# Altium schematic sheet 2-new-T03-V1.Sheet 1.SchDoc
size 594 x 419 mm
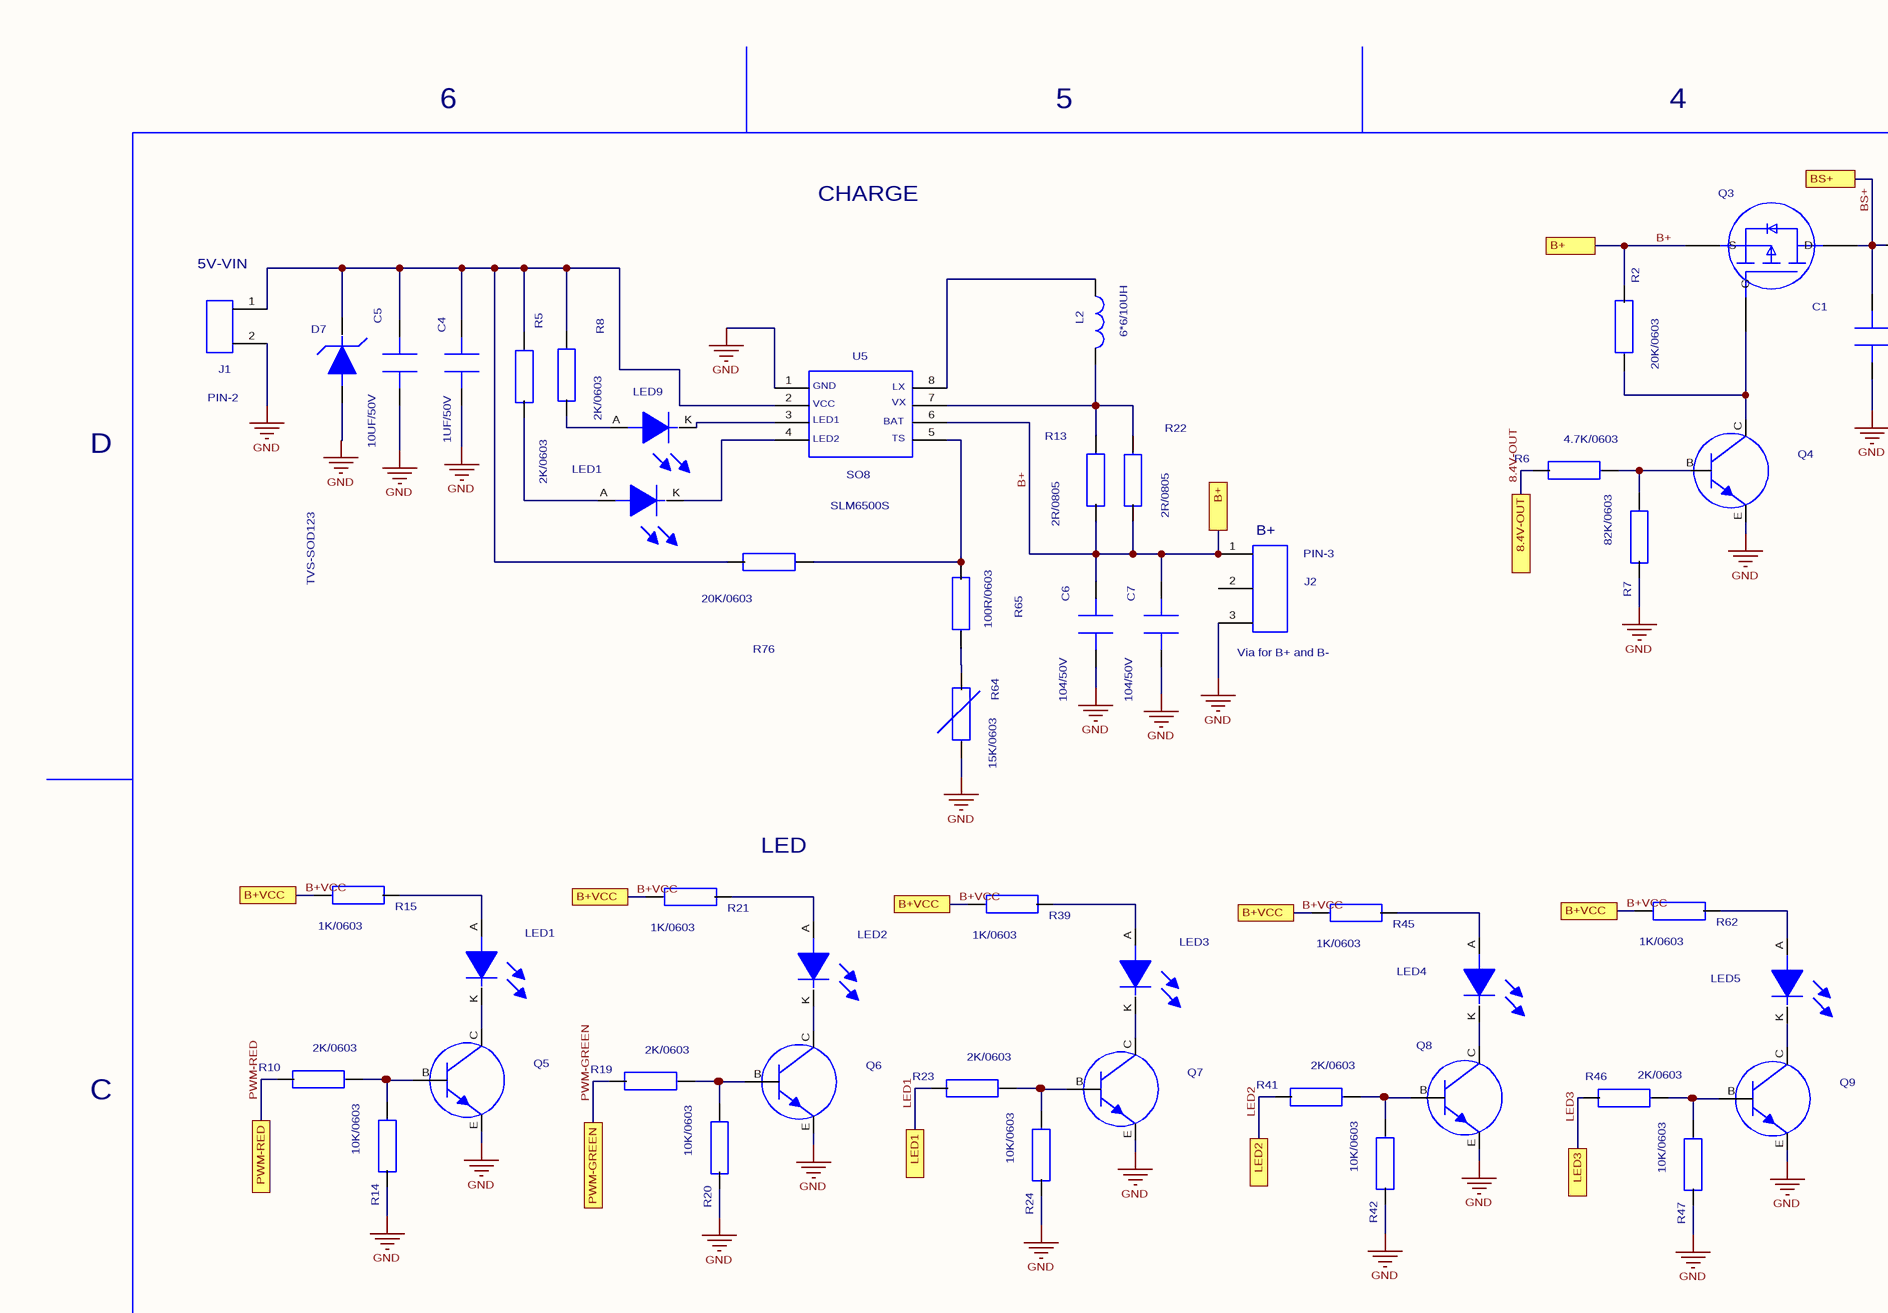
[diagram p0: 2-new-T03-V1.Sheet 1.SchDoc, top left]
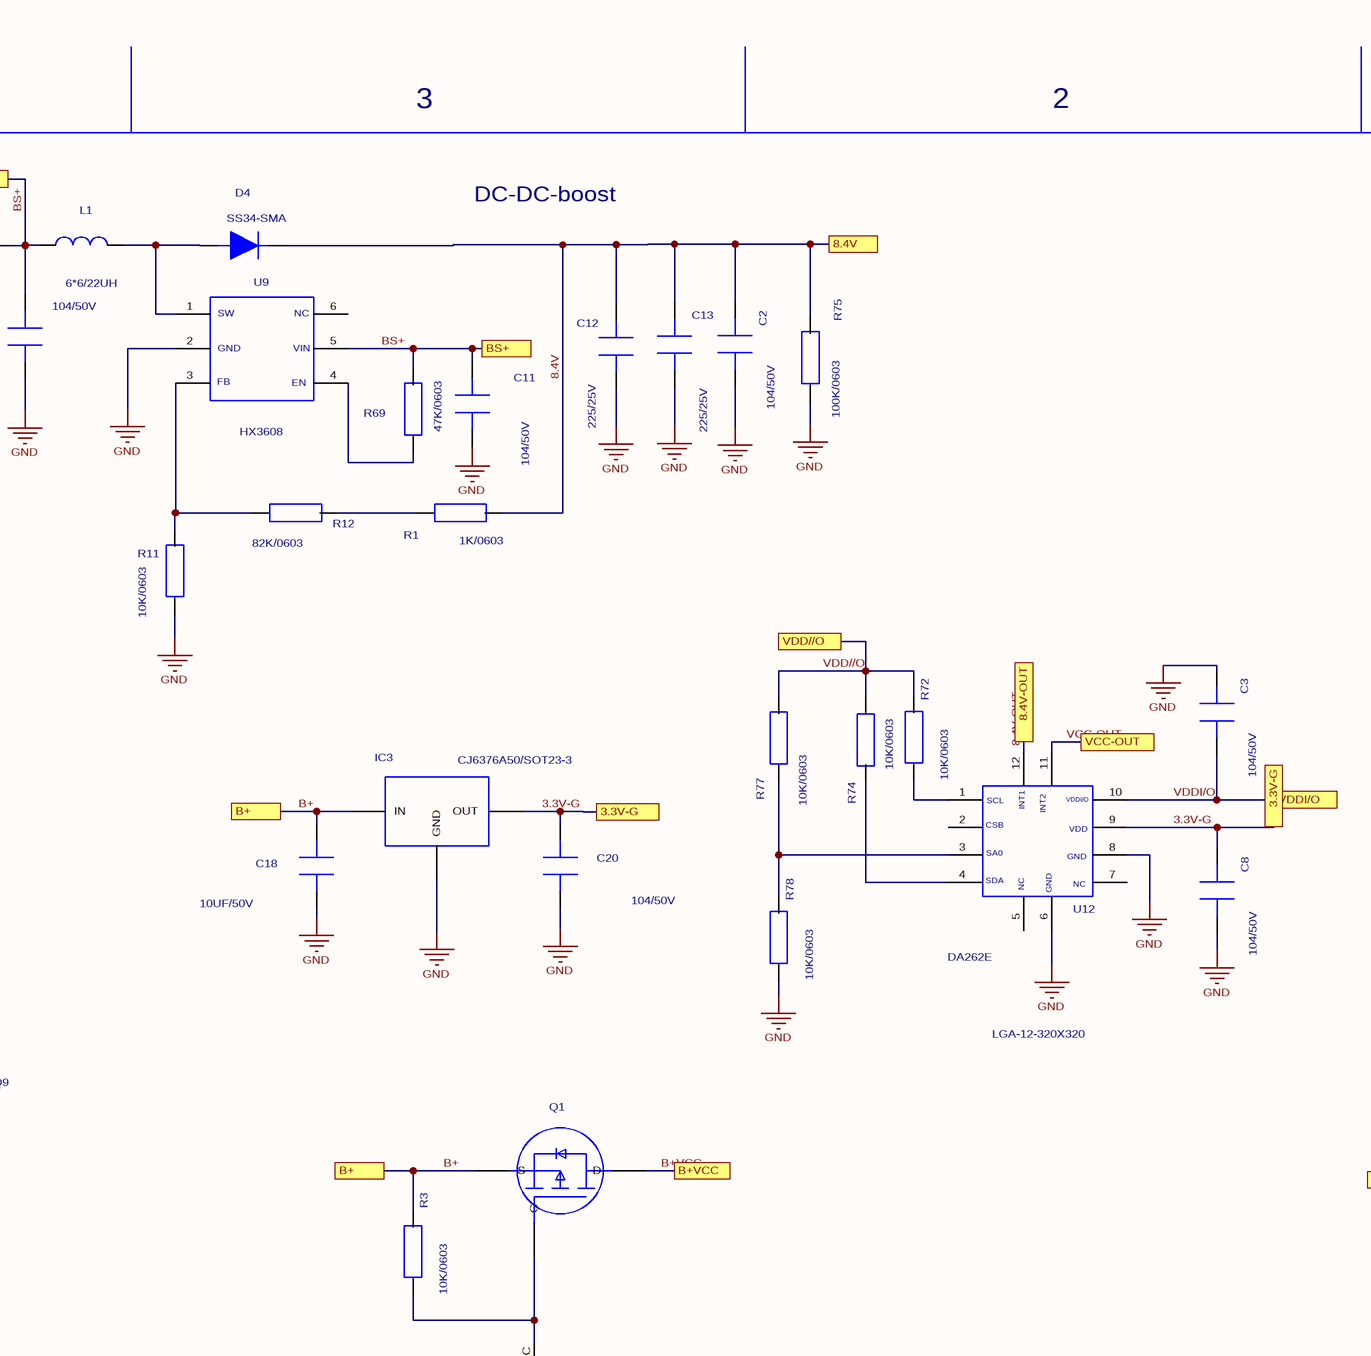
[diagram p1: 2-new-T03-V1.Sheet 1.SchDoc, top middle]
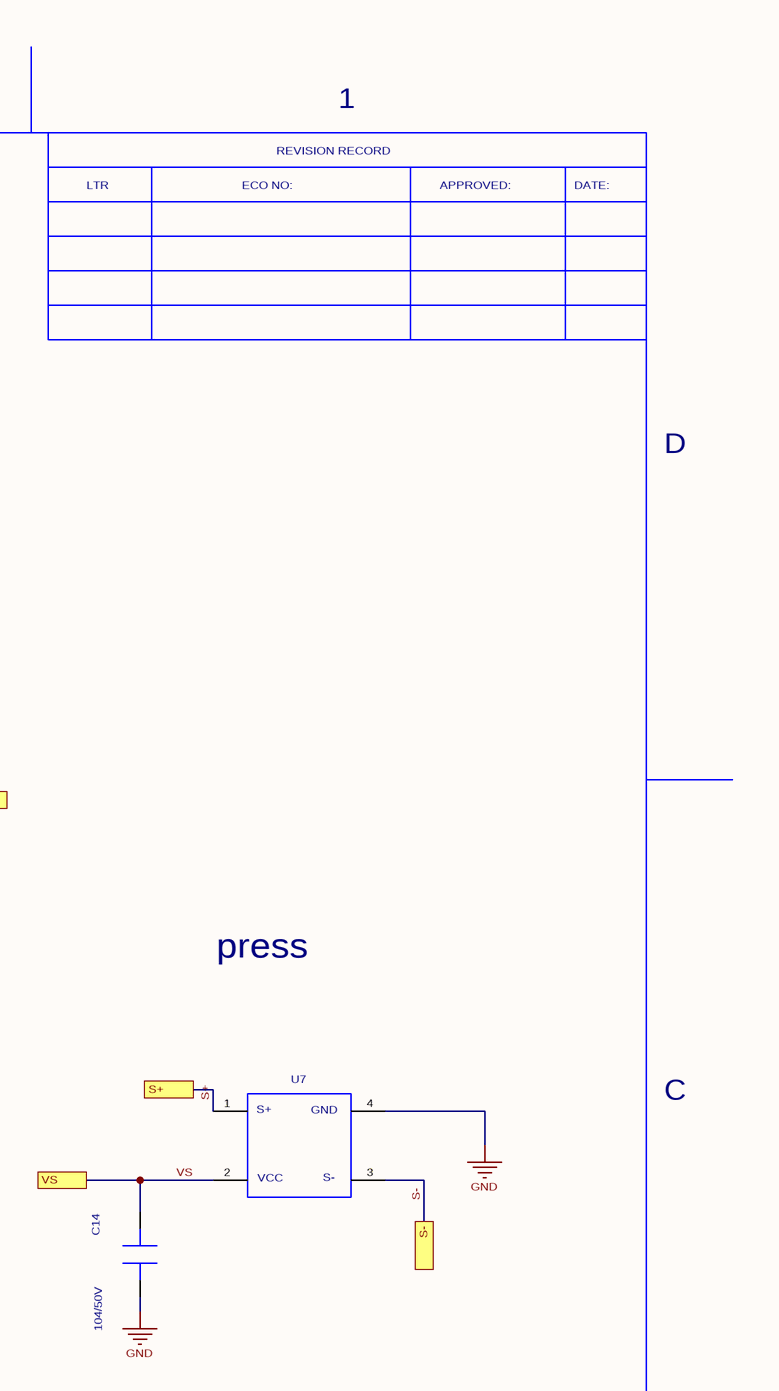
[diagram p2: 2-new-T03-V1.Sheet 1.SchDoc, top right]
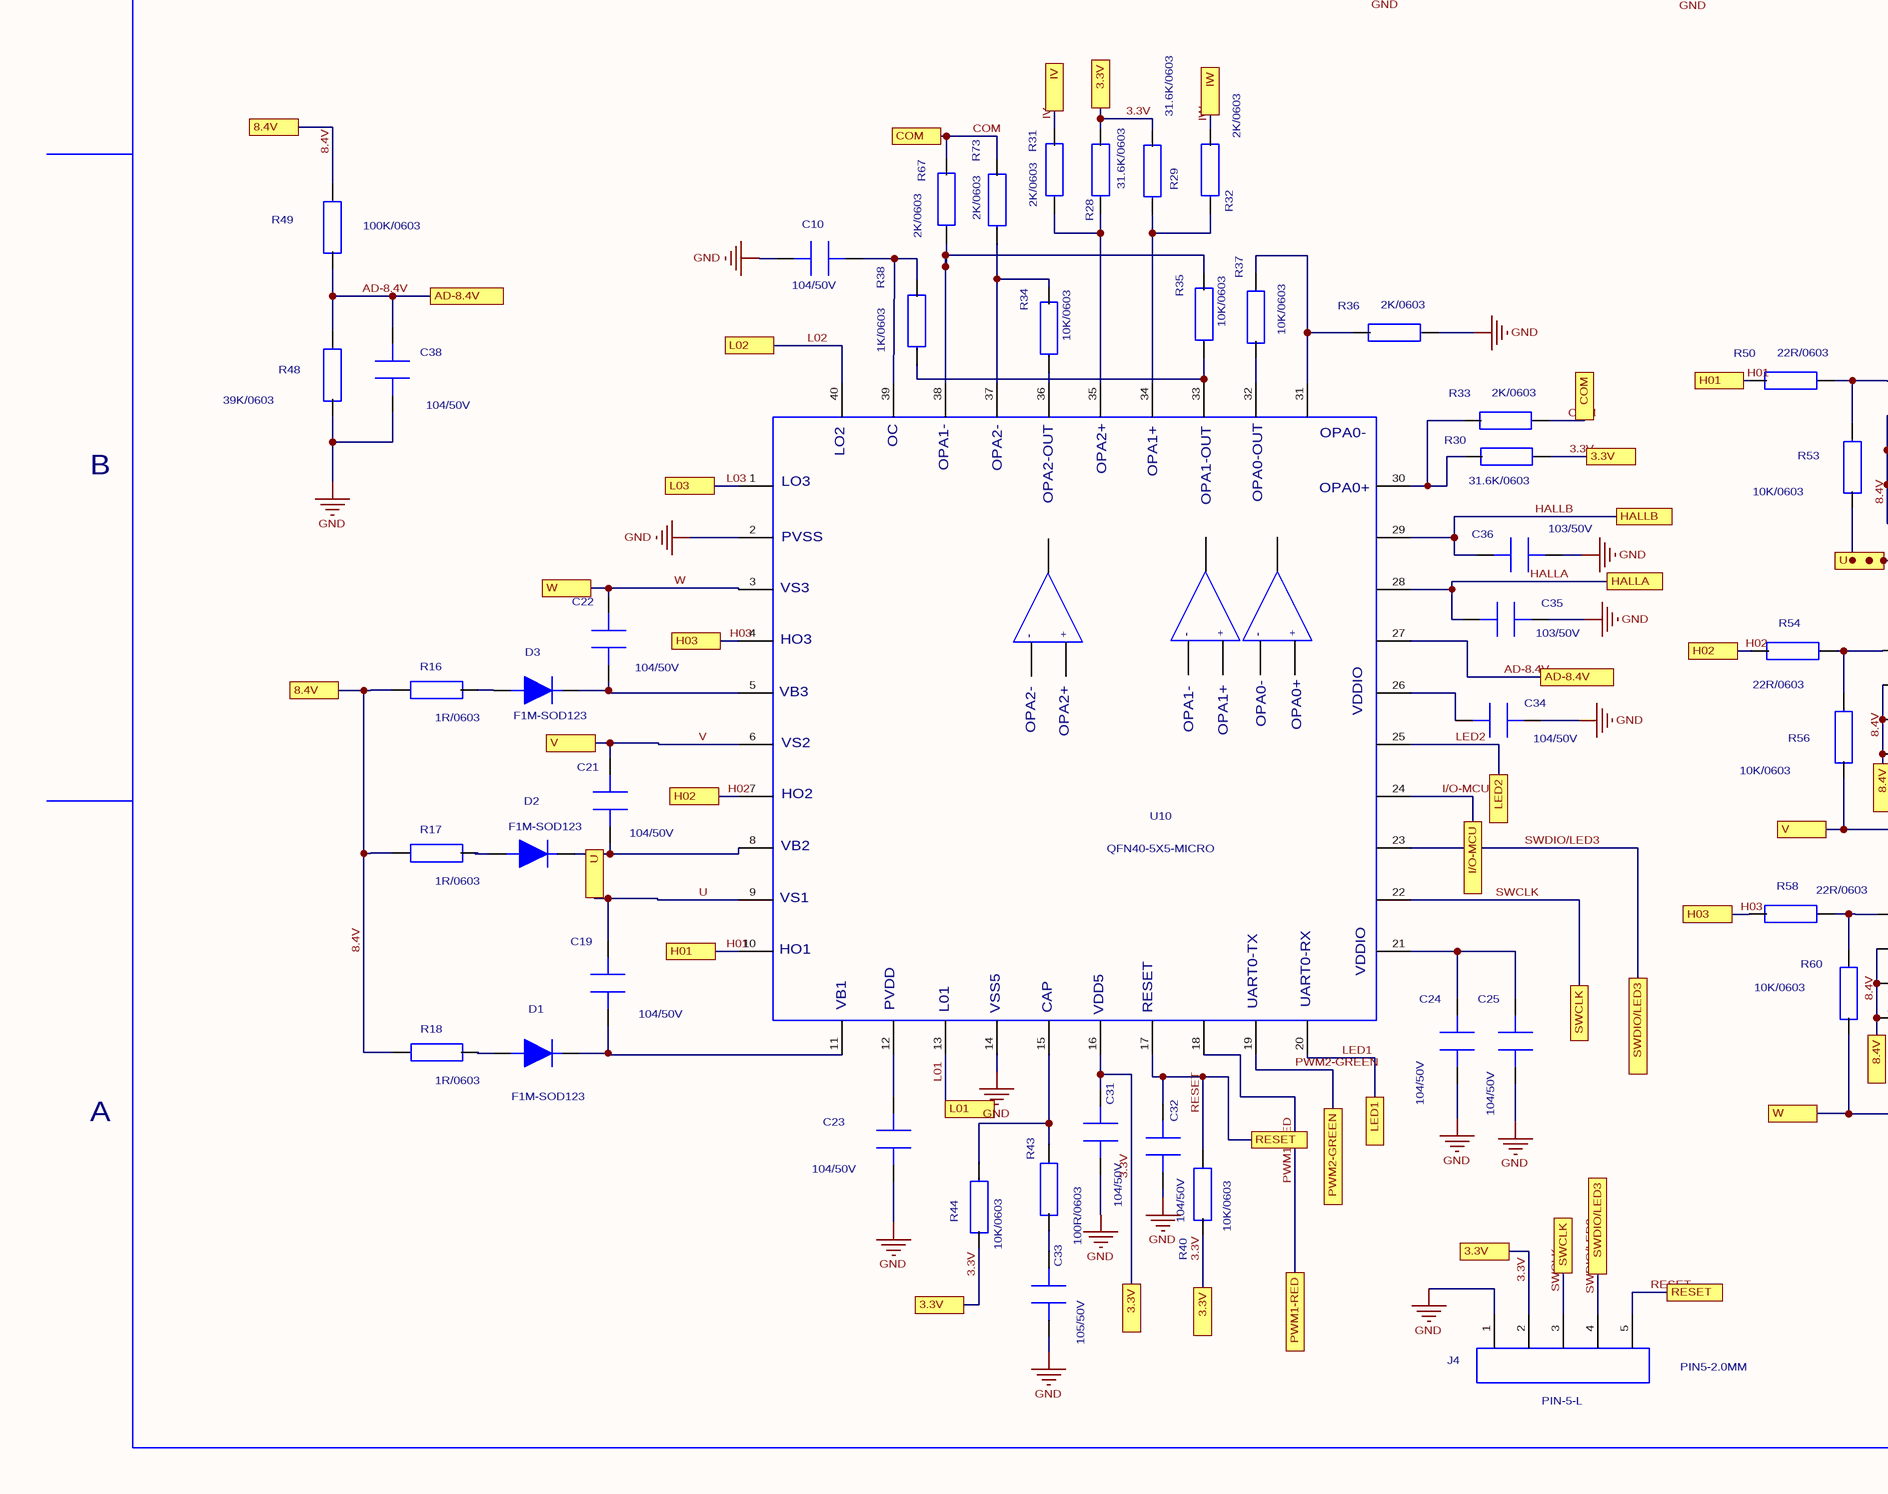
[diagram p3: 2-new-T03-V1.Sheet 1.SchDoc, bottom left]
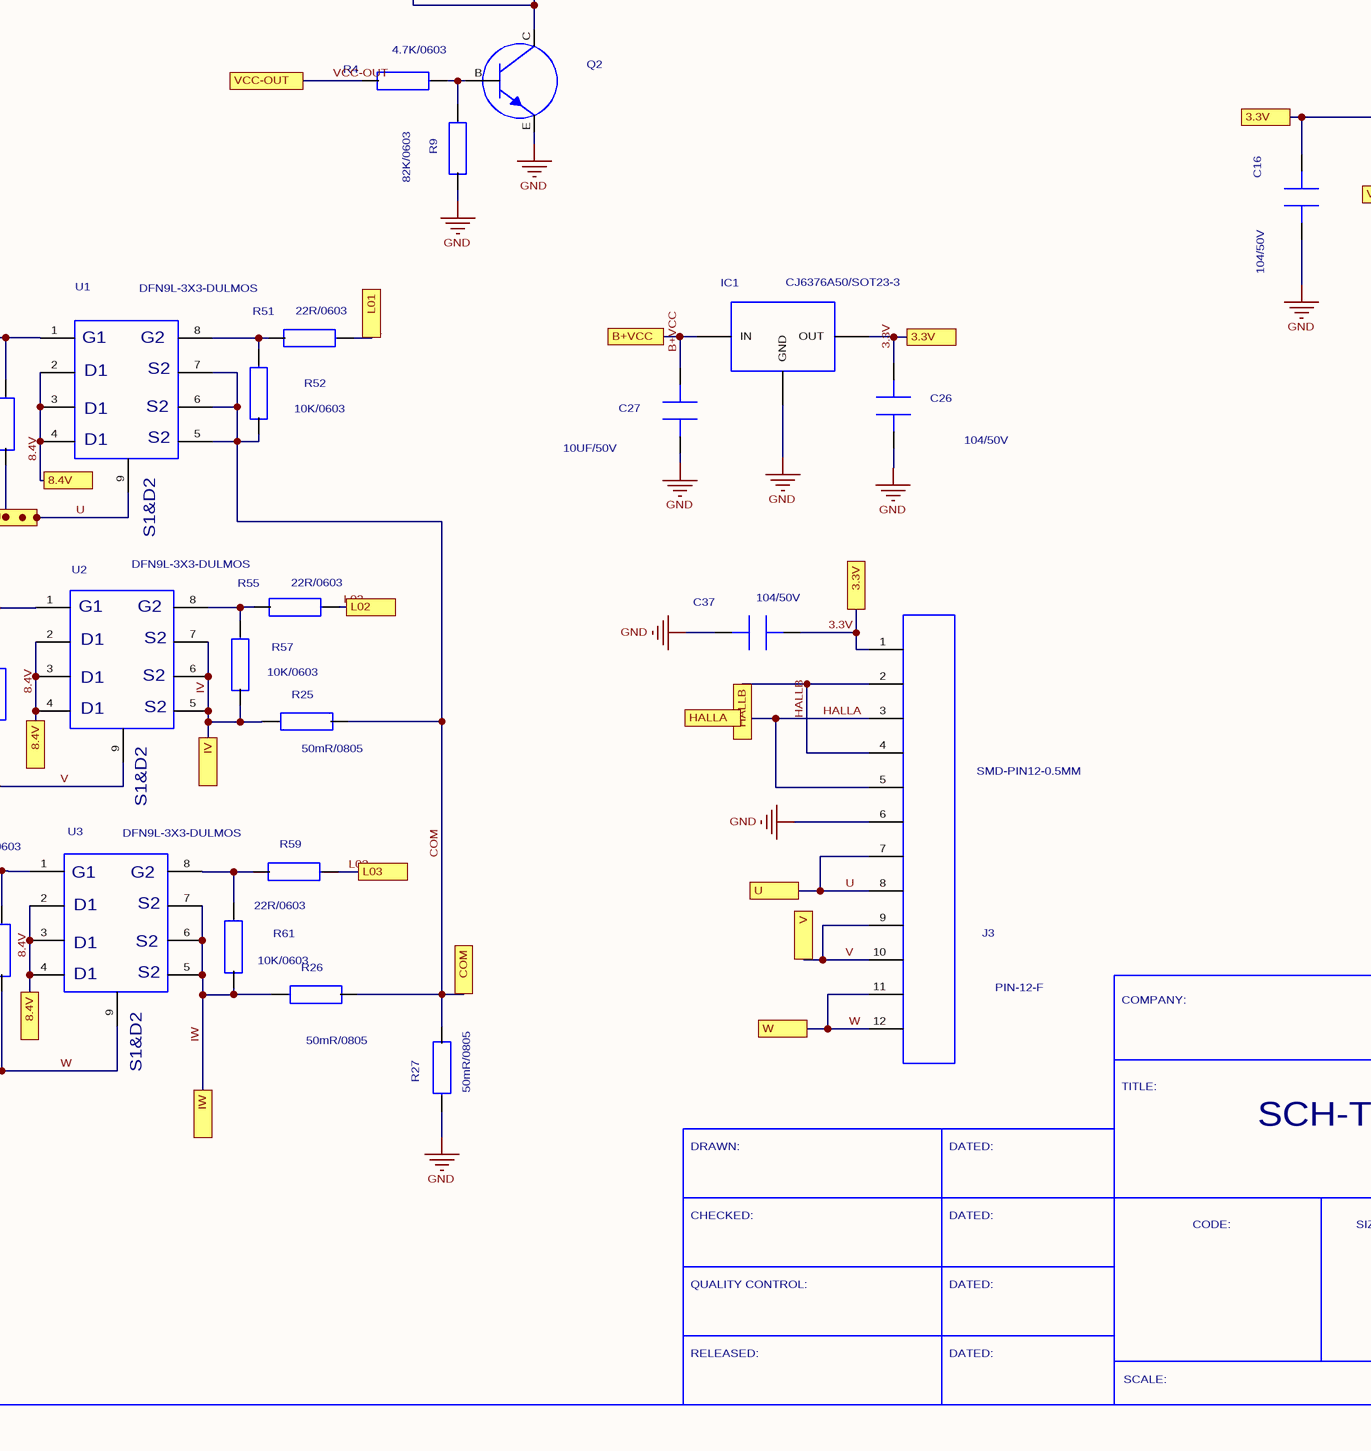
[diagram p4: 2-new-T03-V1.Sheet 1.SchDoc, bottom middle]
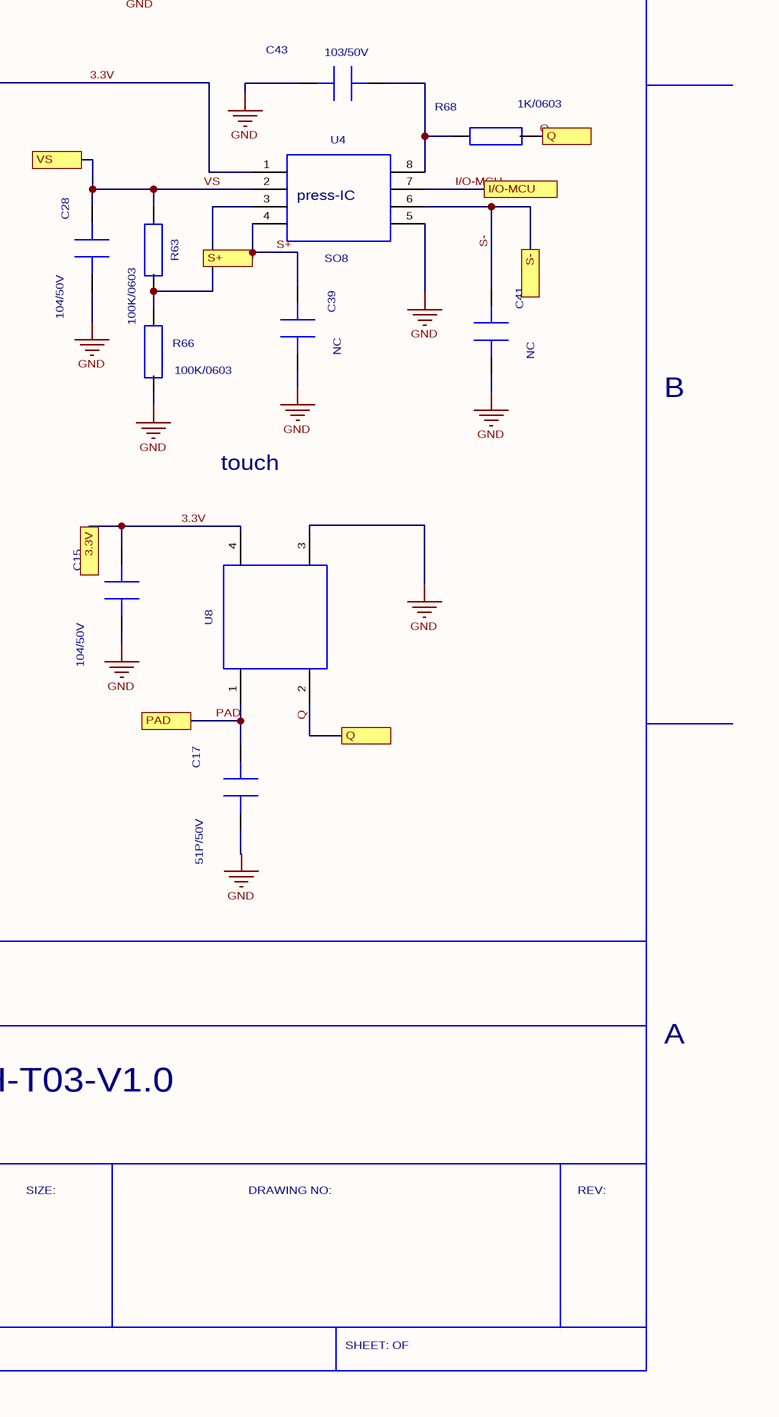
[diagram p5: 2-new-T03-V1.Sheet 1.SchDoc, bottom right]

## Parts
(Parts that share a designator on the sheet are numbered #1, #2 ... from top to bottom, then left to right.)
C1  value 104/50V  [MICA1]  (hidden comment: CAPMICA1)
C2  value 104/50V  [MICA1]  (hidden comment: CAPMICA1)
C3  value 104/50V  [MICA1]  (hidden comment: CAPMICA1)
C4  value 1UF/50V  [MICA1]  (hidden comment: CAPMICA1)
C5  value 10UF/50V  [MICA1]  (hidden comment: CAPMICA1)
C6  value 104/50V  [MICA1]  (hidden comment: CAPMICA1)
C7  value 104/50V  [MICA1]  (hidden comment: CAPMICA1)
C8  value 104/50V  [MICA1]  (hidden comment: CAPMICA1)
C10  value 104/50V  [MICA1]  (hidden comment: CAPMICA1)
C11  value 104/50V  [MICA1]  (hidden comment: CAPMICA1)
C12  value 225/25V  [MICA1]  (hidden comment: CAPMICA1)
C13  value 225/25V  [MICA1]  (hidden comment: CAPMICA1)
C14  value 104/50V  [MICA1]  (hidden comment: CAPMICA1)
C15  value 104/50V  [MICA1]  (hidden comment: CAPMICA1)
C16  value 104/50V  [MICA1]  (hidden comment: CAPMICA1)
C17  value 51P/50V  [MICA1]  (hidden comment: CAPMICA1)
C18  value 10UF/50V  [MICA1]  (hidden comment: CAPMICA1)
C19  value 104/50V  [MICA1]  (hidden comment: CAPMICA1)
C20  value 104/50V  [MICA1]  (hidden comment: CAPMICA1)
C21  value 104/50V  [MICA1]  (hidden comment: CAPMICA1)
C22  value 104/50V  [MICA1]  (hidden comment: CAPMICA1)
C23  value 104/50V  [MICA1]  (hidden comment: CAPMICA1)
C24  value 104/50V  [MICA1]  (hidden comment: CAPMICA1)
C25  value 104/50V  [MICA1]  (hidden comment: CAPMICA1)
C26  value 104/50V  [MICA1]  (hidden comment: CAPMICA1)
C27  value 10UF/50V  [MICA1]  (hidden comment: CAPMICA1)
C28  value 104/50V  [MICA1]  (hidden comment: CAPMICA1)
C31  value 104/50V  [MICA1]  (hidden comment: CAPMICA1)
C32  value 104/50V  [MICA1]  (hidden comment: CAPMICA1)
C33  value 105/50V  [MICA1]  (hidden comment: CAPMICA1)
C34  value 104/50V  [MICA1]  (hidden comment: CAPMICA1)
C35  value 103/50V  [MICA1]  (hidden comment: CAPMICA1)
C36  value 103/50V  [MICA1]  (hidden comment: CAPMICA1)
C37  value 104/50V  [MICA1]  (hidden comment: CAPMICA1)
C38  value 104/50V  [MICA1]  (hidden comment: CAPMICA1)
C39  value NC  [MICA1]  (hidden comment: CAPMICA1)
C41  value NC  [MICA1]  (hidden comment: CAPMICA1)
C43  value 103/50V  [MICA1]  (hidden comment: CAPMICA1)
D1  value F1M-SOD123  [DO7]  (hidden comment: DIODE)
D2  value F1M-SOD123  [DO7]  (hidden comment: DIODE)
D3  value F1M-SOD123  [DO7]  (hidden comment: DIODE)
D4  value SS34-SMA  [DO7]  (hidden comment: DIODE)
D7  ZPD10  [DO35]  (value not drawn)
IC1  value CJ6376A50/SOT23-3  [TO-204AA]  (hidden comment: LM109K)
IC3  value CJ6376A50/SOT23-3  [TO-204AA]  (hidden comment: LM109K)
IC4  LM258  [DIP8]  (value not drawn)  (part A of 2)
IC5  LM258  [DIP8]  (value not drawn)  (part A of 2)
IC6  LM258  [DIP8]  (value not drawn)  (part A of 2)
J1  PIN-2
J2  PIN-3
J3  PIN-12-F
J4  PIN-5-L
L1  value 6*6/22UH  [IND-MOLDED]  (hidden comment: IND-MOLDED)
L2  value 6*6/10UH  [IND-MOLDED]  (hidden comment: IND-MOLDED)
LED1#1  LED  [LED]  (value not drawn)
LED1#2  LED  [LED]  (value not drawn)
LED2  LED  [LED]  (value not drawn)
LED3  LED  [LED]  (value not drawn)
LED4  LED  [LED]  (value not drawn)
LED5  LED  [LED]  (value not drawn)
LED9  LED  [LED]  (value not drawn)
Q1  P-MOS01  [SOT23]  (value not drawn)
Q2  MM3001  [TO-39]  (value not drawn)
Q3  P-MOS01  [SOT23]  (value not drawn)
Q4  MM3001  [TO-39]  (value not drawn)
Q5  MM3001  [TO-39]  (value not drawn)
Q6  MM3001  [TO-39]  (value not drawn)
Q7  MM3001  [TO-39]  (value not drawn)
Q8  MM3001  [TO-39]  (value not drawn)
Q9  MM3001  [TO-39]  (value not drawn)
R1  value 1K/0603  [R2W]  (hidden comment: RES-2W)
R2  value 20K/0603  [R2W]  (hidden comment: RES-2W)
R3  value 10K/0603  [R2W]  (hidden comment: RES-2W)
R4  value 4.7K/0603  [R2W]  (hidden comment: RES-2W)
R5  value 2K/0603  [R2W]  (hidden comment: RES-2W)
R6  value 4.7K/0603  [R2W]  (hidden comment: RES-2W)
R7  value 82K/0603  [R2W]  (hidden comment: RES-2W)
R8  value 2K/0603  [R2W]  (hidden comment: RES-2W)
R9  value 82K/0603  [R2W]  (hidden comment: RES-2W)
R10  value 2K/0603  [R2W]  (hidden comment: RES-2W)
R11  value 10K/0603  [R2W]  (hidden comment: RES-2W)
R12  value 82K/0603  [R2W]  (hidden comment: RES-2W)
R13  value 2R/0805  [R2W]  (hidden comment: RES-2W)
R14  value 10K/0603  [R2W]  (hidden comment: RES-2W)
R15  value 1K/0603  [R2W]  (hidden comment: RES-2W)
R16  value 1R/0603  [R2W]  (hidden comment: RES-2W)
R17  value 1R/0603  [R2W]  (hidden comment: RES-2W)
R18  value 1R/0603  [R2W]  (hidden comment: RES-2W)
R19  value 2K/0603  [R2W]  (hidden comment: RES-2W)
R20  value 10K/0603  [R2W]  (hidden comment: RES-2W)
R21  value 1K/0603  [R2W]  (hidden comment: RES-2W)
R22  value 2R/0805  [R2W]  (hidden comment: RES-2W)
R23  value 2K/0603  [R2W]  (hidden comment: RES-2W)
R24  value 10K/0603  [R2W]  (hidden comment: RES-2W)
R25  value 50mR/0805  [R2W]  (hidden comment: RES-2W)
R26  value 50mR/0805  [R2W]  (hidden comment: RES-2W)
R27  value 50mR/0805  [R2W]  (hidden comment: RES-2W)
R28  value 31.6K/0603  [R2W]  (hidden comment: RES-2W)
R29  value 31.6K/0603  [R2W]  (hidden comment: RES-2W)
R30  value 31.6K/0603  [R2W]  (hidden comment: RES-2W)
R31  value 2K/0603  [R2W]  (hidden comment: RES-2W)
R32  value 2K/0603  [R2W]  (hidden comment: RES-2W)
R33  value 2K/0603  [R2W]  (hidden comment: RES-2W)
R34  value 10K/0603  [R2W]  (hidden comment: RES-2W)
R35  value 10K/0603  [R2W]  (hidden comment: RES-2W)
R36  value 2K/0603  [R2W]  (hidden comment: RES-2W)
R37  value 10K/0603  [R2W]  (hidden comment: RES-2W)
R38  value 1K/0603  [R2W]  (hidden comment: RES-2W)
R39  value 1K/0603  [R2W]  (hidden comment: RES-2W)
R40  value 10K/0603  [R2W]  (hidden comment: RES-2W)
R41  value 2K/0603  [R2W]  (hidden comment: RES-2W)
R42  value 10K/0603  [R2W]  (hidden comment: RES-2W)
R43  value 100R/0603  [R2W]  (hidden comment: RES-2W)
R44  value 10K/0603  [R2W]  (hidden comment: RES-2W)
R45  value 1K/0603  [R2W]  (hidden comment: RES-2W)
R46  value 2K/0603  [R2W]  (hidden comment: RES-2W)
R47  value 10K/0603  [R2W]  (hidden comment: RES-2W)
R48  value 39K/0603  [R2W]  (hidden comment: RES-2W)
R49  value 100K/0603  [R2W]  (hidden comment: RES-2W)
R50  value 22R/0603  [R2W]  (hidden comment: RES-2W)
R51  value 22R/0603  [R2W]  (hidden comment: RES-2W)
R52  value 10K/0603  [R2W]  (hidden comment: RES-2W)
R53  value 10K/0603  [R2W]  (hidden comment: RES-2W)
R54  value 22R/0603  [R2W]  (hidden comment: RES-2W)
R55  value 22R/0603  [R2W]  (hidden comment: RES-2W)
R56  value 10K/0603  [R2W]  (hidden comment: RES-2W)
R57  value 10K/0603  [R2W]  (hidden comment: RES-2W)
R58  value 22R/0603  [R2W]  (hidden comment: RES-2W)
R59  value 22R/0603  [R2W]  (hidden comment: RES-2W)
R60  value 10K/0603  [R2W]  (hidden comment: RES-2W)
R61  value 10K/0603  [R2W]  (hidden comment: RES-2W)
R62  value 1K/0603  [R2W]  (hidden comment: RES-2W)
R63  value 100K/0603  [R2W]  (hidden comment: RES-2W)
R64  value 15K/0603  [R2W]  (hidden comment: RES-2W)
R65  value 100R/0603  [R2W]  (hidden comment: RES-2W)
R66  value 100K/0603  [R2W]  (hidden comment: RES-2W)
R67  value 2K/0603  [R2W]  (hidden comment: RES-2W)
R68  value 1K/0603  [R2W]  (hidden comment: RES-2W)
R69  value 47K/0603  [R2W]  (hidden comment: RES-2W)
R72  value 10K/0603  [R2W]  (hidden comment: RES-2W)
R73  value 2K/0603  [R2W]  (hidden comment: RES-2W)
R74  value 10K/0603  [R2W]  (hidden comment: RES-2W)
R75  value 100K/0603  [R2W]  (hidden comment: RES-2W)
R76  value 20K/0603  [R2W]  (hidden comment: RES-2W)
R77  value 10K/0603  [R2W]  (hidden comment: RES-2W)
R78  value 10K/0603  [R2W]  (hidden comment: RES-2W)
U1  DFN9L-3X3-DULMOS
U2  DFN9L-3X3-DULMOS
U3  DFN9L-3X3-DULMOS
U4  SO8  [SO8NB]
U5  SO8  value SLM6500S  [SO8NB]
U7  SO4MM  [SO4M1]  (value not drawn)
U8  SO4MM  [SO4M1]  (value not drawn)
U9  value HX3608  [SO6M1]  (hidden comment: SO6MM)
U10  QFN40-5X5-MICRO
U12  LGA-12-320X320  value DA262E

## Ports
3.3V, 3.3V-G, 8.4V, 8.4V-OUT, AD-8.4V, B+, B+VCC, BS+, COM, H01, H02, H03, HALLA, HALLB, I/O-MCU, IV, IW, L01, L02, L03, LED1, LED2, LED3, PAD, PWM1-RED, PWM2-GREEN, PWM-GREEN, PWM-RED, Q, RESET, S+, S-, SWCLK, SWDIO/LED3, U, V, VCC-OUT, VDD//O, VDDI/O, VS, W

## Nets
+15V: IC4.8(+15V) IC5.8(+15V) IC6.8(+15V)
-15V: IC4.4(-15V) IC5.4(-15V) IC6.4(-15V)
GND: C1.2 C2.1 C3.2 C4.1 C5.1 C6.1 C7.1 C8.1 C10.2 C11.1 C12.1 C13.1 C14.1 C15.1 C16.1 C17.1 C18.1 C20.1 C23.1 C24.1 C25.1 C26.1 C27.1 C28.1 C31.1 C32.1 C33.1 C34.1 C35.2 C36.2 C37.2 C38.2 C39.1 C41.1 C43.1 D7.A IC1.3(GND) IC3.3(GND) J1.2 J2.3 J3.6 J4.1 Q2.E Q4.E Q5.E Q6.E Q7.E Q8.E Q9.E R7.2 R9.2 R11.1 R14.2 R20.2 R24.2 R27.1 R36.1 R42.2 R47.2 R48.2 R64.1 R66.2 R75.1 R78.1 U4.5 U5.1 U7.4 U8.3 U9.2 U10.2 U10.14 U12.6 U12.8
3.3V: C15.2 C16.2 C26.2 C31.2 C37.1 IC1.2(OUT) J3.1 J4.2 R28.2 R29.2 R30.1 R40.2 R44.2 U4.1 U8.4 U10.16 ; port 3.3V
3.3V-G: C8.2 C20.2 IC3.2(OUT) U12.9 ; port 3.3V-G
8.4V: C2.2 C12.2 C13.2 D4.K R1.2 R16.1 R17.1 R18.1 R49.1 R75.2 U1.2 U1.3 U1.4 U2.2 U2.3 U2.4 U3.2 U3.3 U3.4 ; port 8.4V
8.4V-OUT: R6.2 U12.12 ; port 8.4V-OUT
AD-8.4V: C38.1 R48.1 R49.2 U10.27 ; port AD-8.4V
B+: C6.2 C7.2 C18.2 IC3.1(IN) J2.1 Q1.S Q3.S R2.2 R3.2 R13.2 R22.2 U5.6 ; port B+
B+VCC: C27.2 IC1.1(IN) Q1.D R15.1 R21.1 R39.1 R45.1 R62.1 ; port B+VCC
BS+: C1.1 C11.2 L1.2 Q3.D R69.2 U9.5 ; port BS+
COM: R25.2 R26.2 R27.2 R33.1 R52.2 R67.2 R73.2 U1.5 U1.6 U1.7 ; port COM
H01: R50.2 U10.10 ; port H01
H02: R54.2 U10.7 ; port H02
H03: R58.2 U10.4 ; port H03
HALLA: C35.1 C36.1 J3.2 J3.3 J3.4 J3.5 U10.28 U10.29 ; port HALLB, port HALLA  [also labelled HALLB]
I/O-MCU: U4.7 U10.24 ; port I/O-MCU
IV: R25.1 R31.2 R57.2 U2.5 U2.6 U2.7 ; port IV
IW: R26.1 R32.2 R61.2 U3.5 U3.6 U3.7 ; port IW
L01: R51.1 U10.13 ; port L01
L02: R55.1 U10.40 ; port L02
L03: R59.1 U10.1 ; port L03
LED1: R23.2 U10.20 ; port LED1
LED2: R41.2 U10.25 ; port LED2
LED3: R46.2 ; port LED3
PAD: C17.2 U8.1 ; port PAD
PWM1-RED: U10.18 ; port PWM1-RED
PWM2-GREEN: U10.19 ; port PWM2-GREEN
PWM-GREEN: R19.2 ; port PWM-GREEN
PWM-RED: R10.2 ; port PWM-RED
Q: R68.2 U8.2 ; port Q
RESET: C32.2 J4.5 R40.1 U10.17 ; port RESET
S+: C39.2 U4.4 U7.1 ; port S+
S-: C41.2 U4.6 U7.3 ; port S-
SWCLK: J4.3 U10.22 ; port SWCLK
SWDIO/LED3: J4.4 U10.23 ; port SWDIO/LED3
U: C19.2 J3.7 J3.8 R53.2 U1.9 U10.9 ; port U
V: C21.2 J3.9 J3.10 R56.2 U2.9 U10.6 ; port V
VCC-OUT: R4.2 U12.11 ; port VCC-OUT
VDD//O: R72.2 R74.1 R77.2 ; port VDD//O
VDDI/O: C3.1 U12.10 ; port VDDI/O
VS: C14.2 C28.2 R63.1 U4.2 U7.2 ; port VS
W: C22.2 J3.11 J3.12 R60.2 U3.9 U10.3 ; port W
NetC4_2: C4.2 C5.2 D7.K J1.1 R5.1 R8.1 R76.2 U5.2
NetC10_1: C10.1 R38.2 U10.39
NetC19_1: C19.1 D1.K U10.11
NetC21_1: C21.1 D2.K U10.8
NetC22_1: C22.1 D3.K U10.5
NetC23_2: C23.2 U10.12
NetC24_2: C24.2 C25.2 U10.21
NetC33_2: C33.2 R43.2
NetC34_2: C34.2 U10.26
NetC43_2: C43.2 R68.1 U4.8
NetD1_A: D1.A R18.2
NetD2_A: D2.A R17.2
NetD3_A: D3.A R16.2
NetD4_A: D4.A L1.1 U9.1
NetL2_1: L2.1 R13.1 R22.1 U5.7
NetL2_2: L2.2 U5.8
NetLED1#1_A: LED1#1.A R5.2
NetLED1#1_K: LED1#1.K U5.4
NetLED1#2_A: LED1#2.A R15.2
NetLED1#2_K: LED1#2.K Q5.C
NetLED2_A: LED2.A R21.2
NetLED2_K: LED2.K Q6.C
NetLED3_A: LED3.A R39.2
NetLED3_K: LED3.K Q7.C
NetLED4_A: LED4.A R45.2
NetLED4_K: LED4.K Q8.C
NetLED5_A: LED5.A R62.2
NetLED5_K: LED5.K Q9.C
NetLED9_A: LED9.A R8.2
NetLED9_K: LED9.K U5.3
NetQ1_G: Q1.G Q2.C R3.1
NetQ2_B: Q2.B R4.1 R9.1
NetQ3_G: Q3.G Q4.C R2.1
NetQ4_B: Q4.B R6.1 R7.1
NetQ5_B: Q5.B R10.1 R14.1
NetQ6_B: Q6.B R19.1 R20.1
NetQ7_B: Q7.B R23.1 R24.1
NetQ8_B: Q8.B R41.1 R42.1
NetQ9_B: Q9.B R46.1 R47.1
NetR1_1: R1.1 R12.2
NetR11_2: R11.2 R12.1 U9.3
NetR28_1: R28.1 R31.1 U10.35
NetR29_1: R29.1 R32.1 U10.34
NetR30_2: R30.2 R33.2 U10.30
NetR34_1: R34.1 U10.36
NetR34_2: R34.2 R73.1 U10.37
NetR35_1: R35.1 R38.1 U10.33
NetR35_2: R35.2 R67.1 U10.38
NetR36_2: R36.2 R37.1 U10.31
NetR37_2: R37.2 U10.32
NetR43_1: R43.1 R44.1 U10.15
NetR50_1: R50.1 R53.1 U1.1
NetR51_2: R51.2 R52.1 U1.8
NetR54_1: R54.1 R56.1 U2.1
NetR55_2: R55.2 R57.1 U2.8
NetR58_1: R58.1 R60.1 U3.1
NetR59_2: R59.2 R61.1 U3.8
NetR63_2: R63.2 R66.1 U4.3
NetR64_2: R64.2 R65.1
NetR65_2: R65.2 R76.1 U5.5
NetR69_1: R69.1 U9.4
NetR72_1: R72.1 U12.1
NetR74_2: R74.2 U12.4
NetR77_1: R77.1 R78.2 U12.3

Not connected (* = marked no-connect by the designer): IC4 1 2 3; IC5 1 2 3; IC6 1 2 3; J2 2; U9 6; U12 2 5 7

## Notes on the sheet
- 6
- 5
- 4
- 3
- 2
- REVISION RECORD
- 1
- CHARGE
- DC-DC-boost
- LTR
- ECO NO:
- APPROVED:
- DATE:
- (near J1) 5V-VIN
- (near U9) SW
- (near U9) NC
- (near U5) GND
- (near U5) VCC
- (near U5) LED1
- (near U5) BAT
- (near U5) VX
- (near U5) LX
- (near U9) FB
- (near U9) GND
- (near U9) EN
- (near U9) VIN
- D
- (near U5) LED2
- (near U5) TS
- TVS-SOD123
- (near J2) B+
- (near J2) Via for B+ and B-
- LED
- (near U12) CSB
- (near U12) SA0
- (near U12) SCL
- (near U12) INT1
- (near U12) INT2
- (near U12) GND
- (near U12) VDD
- (near U12) VDDI/O
- (near U12) SDA
- (near U12) NC
- press
- C
- (near U7) S+
- (near U7) GND
- (near U7) VCC
- (near U7) S-
- (near U4) press-IC
- (near U10) OC
- (near U10) OPA1-
- (near U10) OPA2-
- (near U10) OPA2-OUT
- (near U10) OPA2+
- (near U10) OPA1+
- (near U10) OPA1-OUT
- (near U10) OPA0-OUT
- (near U10) OPA0-
- (near U1) G1
- (near U1) D1
- (near U1) G2
- (near U1) S2
- B
- (near U10) LO3
- (near U10) LO2
- (near U10) OPA0+
- (near U10) VS3
- (near U10) PVSS
- (near U1) S1&D2
- touch
- (near U10) VB3
- (near U10) HO3
- (near U10) VDDIO
- (near U2) G1
- (near U2) D1
- (near U2) G2
- (near U2) S2
- (near U10) VS2
- (near U10) VB2
- (near U10) HO2
- (near U2) S1&D2
- SMD-PIN12-0.5MM
- (near U10) HO1
- (near U10) VS1
- (near U3) G1
- (near U3) D1
- (near U3) G2
- (near U3) S2
- (near U10) VB1
- (near U10) PVDD
- (near U10) L01
- (near U10) VSS5
- (near U10) CAP
- (near U10) VDD5
- (near U10) RESET
- (near U10) UART0-TX
- (near U10) UART0-RX
- COMPANY:
- A
- (near U3) S1&D2
- TITLE:
- DRAWN:
- DATED:
- SCH-T03-V1.0
- CHECKED:
- CODE:
- SIZE:
- DRAWING NO:
- REV:
- (near J4) PIN5-2.0MM
- RELEASED:
- QUALITY CONTROL:
- SCALE:
- SHEET: OF
- (in symbol LM258, part A) -; +

## Library data of the parts
C1-C8 C10-C28 C31-C39 C41 C43 = CAPMICA1: MICA TANTALUM CAPACITOR 5.69 X 10.9 MM; Manufacturer #1: IPC SM-782 STD.; PCB DECAL: MICA1
D1-D4 = DIODE: GENERIC DIODE W ALTERNATE; PCB DECAL: DO7
D7 = ZPD10: ZENER VOLTAGE REGULATOR DIODE, VZ=10V; Manufacturer #1: MOTOROLA; Part Number: ZPD10; PCB DECAL: DO35
IC1 IC3 = LM109K: POSITIVE VOLTAGE REGULATOR; FIXED +5VOLTS; Part Number: LM109 (K,H); Manufacturer #1: MOTOROLA; PCB DECAL: TO-204AA
IC4-IC6 = LM258: DUAL DIFFERENTIAL INPUT OPERATIONAL AMPLFIER; Part Number: LM258 (N,D,H,J); Manufacturer #1: MOTOROLA; PCB DECAL: DIP8
L1 L2 = IND-MOLDED: MOLDED INDUCTOR, 0.5" PIN SPACING; PCB DECAL: IND-MOLDED
LED1#1 LED1#2 LED2-LED5 LED9 = LED: LIGHT EMITTING DIODE; Sim.Analog.Order: Model$; Sim.Analog.Prefix: D; Color: ???; PCB DECAL: LED
Q1 Q3 = P-MOS01: N-CHANNEL,ENHANCEMENT MODE, TMOS FET; Part Number: MMBF170LT1; Manufacturer #1: MOTOROLA; Value: 10N65; PCB DECAL: SOT23
Q2 Q4-Q9 = MM3001: GENERAL PURPOSE NPN SILICON TRANSISTOR; Manufacturer #1: MOTOROLA; Part Number: MM3001; PCB DECAL: TO-39
R1-R69 R72-R78 = RES-2W: RES  BODY:340  CENTERS:1000; Part Number: R7; PCB DECAL: R2W
U4 U5 = SO8: GENERIC 8 PIN SMT; PCB DECAL: SO8NB
U7 U8 = SO4MM: GENERIC 4 PIN SMT METRIC; PCB DECAL: SO4M1
U9 = SO6MM: GENERIC 6 PIN SMT METRIC; PCB DECAL: SO6M1